# Altium schematic sheet 19V-PC-POWER.SchDoc
size B
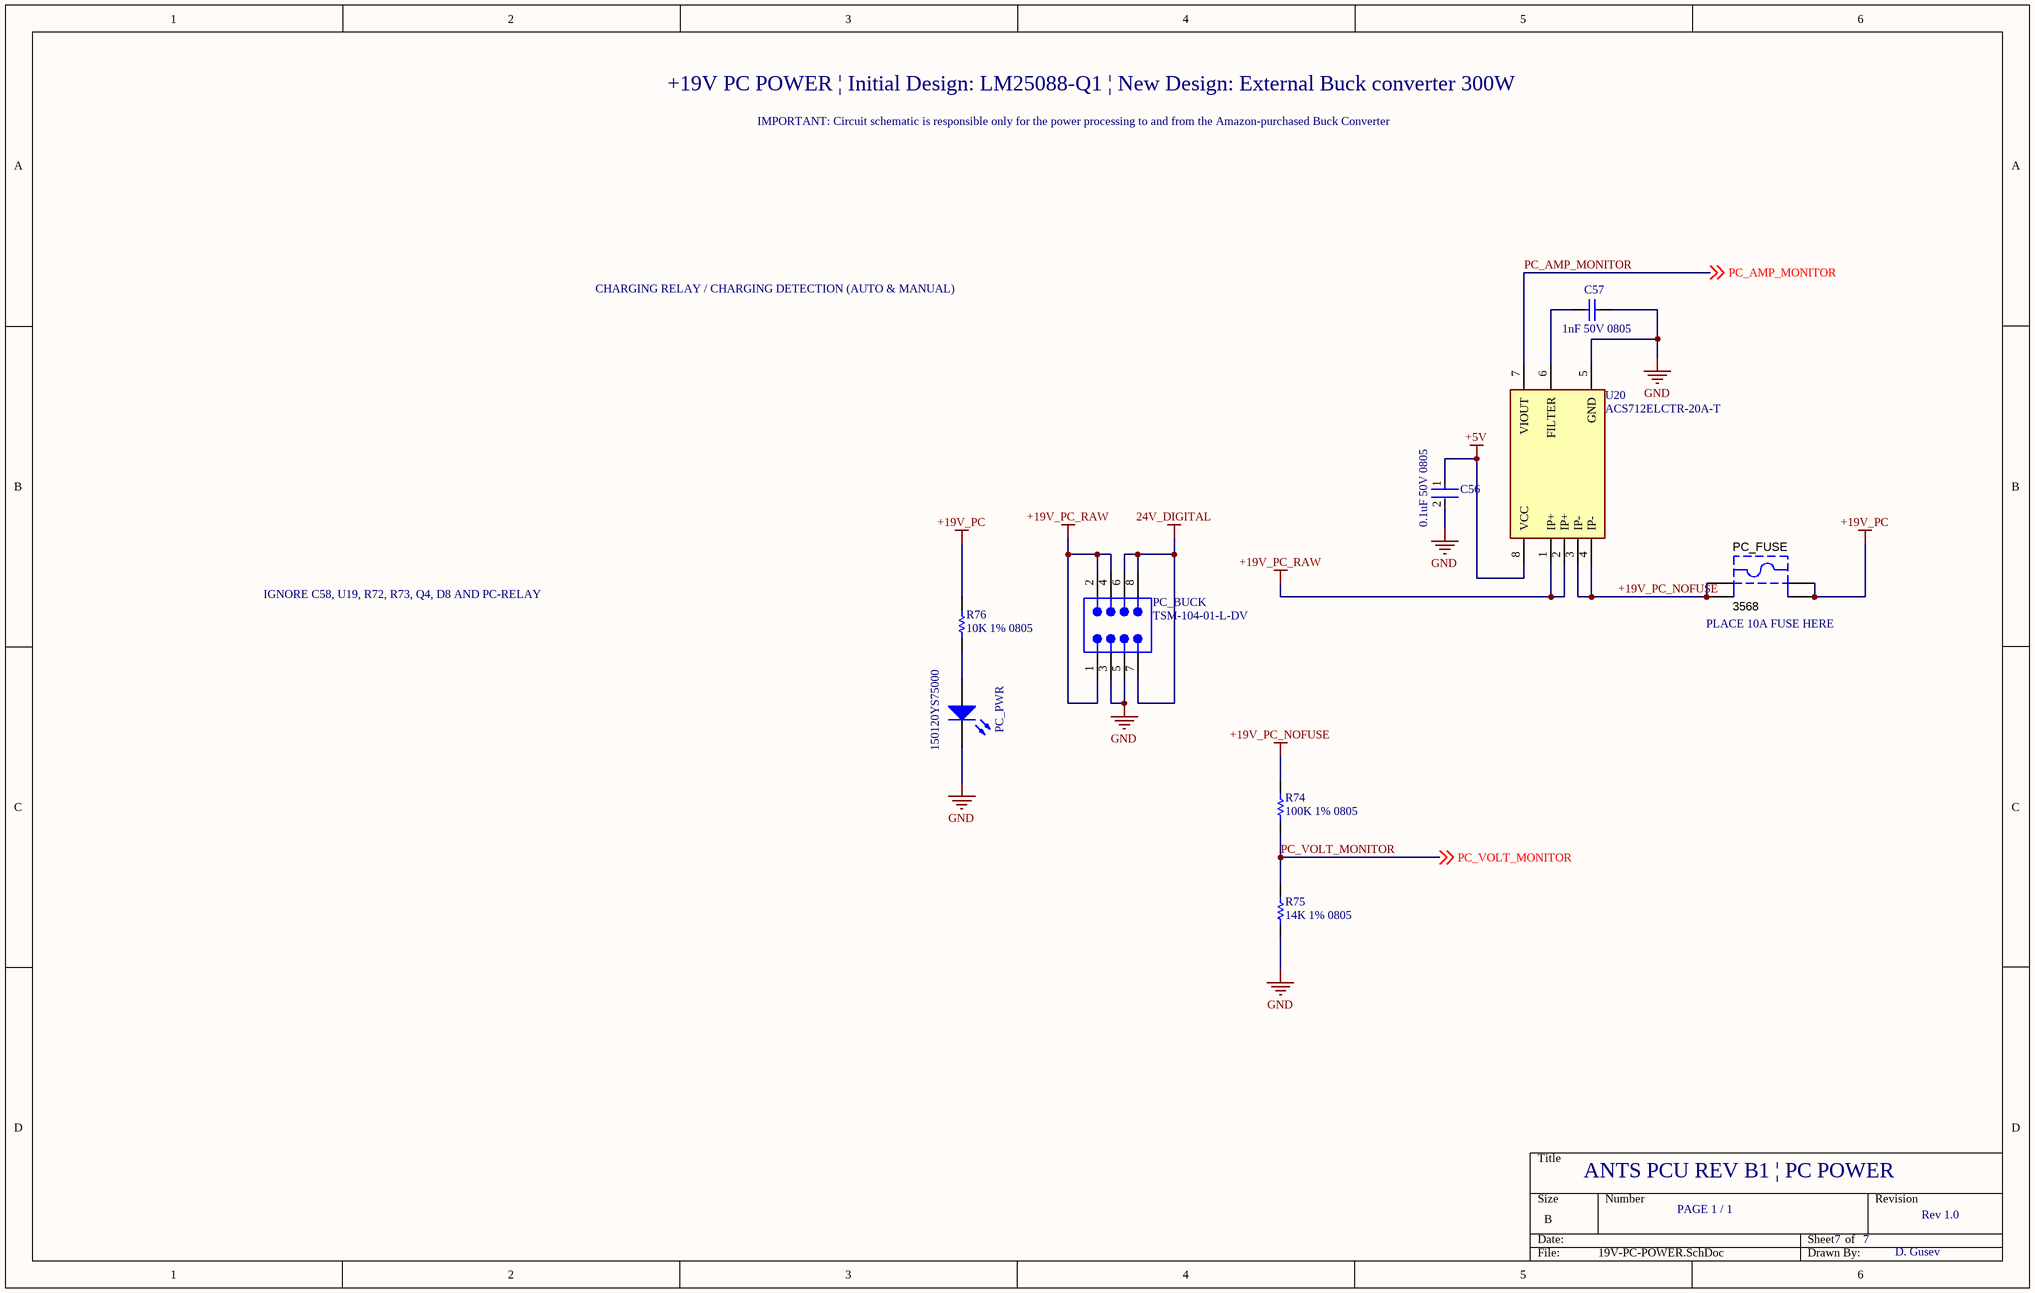
[diagram p0: 19V-PC-POWER.SchDoc]

## Parts
C56  0.1uF 50V 0805  [FP-C0805C-DN-MFG]
C57  1nF 50V 0805  [CAPC2013X94X50ML20T25]
PC_BUCK  TSM-104-01-L-DV  [SMTC-TSM-104-01-X-DV]
PC_FUSE  3568  [KSTN-3568_V]
PC_PWR  150120YS75000  [1206_A]
R74  100K 1% 0805  [RESC2013X60X35ML10T20]
R75  14K 1% 0805  [RESC2013X60X35LL10T20]
R76  10K 1% 0805  [RESC2013X60X35NL10T20]
U20  ACS712ELCTR-20A-T  [FP-LC-8-IPC_C]

## Nets
24V_DIGITAL: PC_BUCK.6 PC_BUCK.7 PC_BUCK.8
+5V: C56.1 U20.8(VCC)
+19V_PC: PC_FUSE.1 PC_FUSE.2 R76.1
+19V_PC_NOFUSE: PC_FUSE.3 PC_FUSE.4 R74.2 U20.3(IP-) U20.4(IP-)
+19V_PC_RAW: PC_BUCK.1 PC_BUCK.2 PC_BUCK.4 U20.1(IP+) U20.2(IP+)
GND: C56.2 C57.2 PC_BUCK.3 PC_BUCK.5 PC_PWR.1(K) R75.1 U20.5(GND)
PC_AMP_MONITOR: U20.7(VIOUT) ; off-sheet PC_AMP_MONITOR
PC_VOLT_MONITOR: R74.1 R75.2 ; off-sheet PC_VOLT_MONITOR
NetC57_1: C57.1 U20.6(FILTER)
NetPC_PWR_2: PC_PWR.2(A) R76.2

## Notes on the sheet
- +19V PC POWER | Initial Design: LM25088-Q1 | New Design: External Buck converter 300W
- IMPORTANT: Circuit schematic is responsible only for the power processing to and from the Amazon-purchased Buck Converter
- CHARGING RELAY / CHARGING DETECTION (AUTO & MANUAL)
- IGNORE C58, U19, R72, R73, Q4, D8 AND PC-RELAY
- (near PC_FUSE) PLACE 10A FUSE HERE
- ANTS PCU REV B1 | PC POWER
- PAGE 1 / 1
- 7
- Rev 1.0
- D. Gusev

## Library data of the parts
C56 = CMP-2007-00279-2: CAP CER 0.1UF 50V X7R 0805; Manufacturer Part Number: C0805C104K5RACTU; Manufacturer: KEMET; Value: 0.10 μF; Tolerance: 0.1; Temperature Coefficient: 30ppm/°C; Material: Ceramic; Device Class L2: Capacitors; Temperature Range Low: -55°C; Voltage Rating: 50 V; Digikey Description: CAP CER 0.1UF 50V X7R 0805; Category: Cap; ComponentLink2Description: Datasheet; Octopart: https://octopart.com/c0805c104k5ractu-kemet-143926; RoHS: TRUE; ComponentLink2URL: https://content.kemet.com/datasheets/KEM_C1003_C0G_SMD.pdf; Temperature Characteristic: X7R; Temperature: -55°C to +125°C; Height: 0.88mm; Temperature Range High: +125°C; Device Class L1: Passive Components; Automotive: No; Lead Free: Yes; Ipc Land Pattern Name: CAPC200125X78; Device Class L3: Ceramic Capacitors; Mouser Description: Cap Ceramic 0.1uF 50V X7R 10% SMD 2.0 x 1.2 mm 125 C Paper T/R; Capacitance: 0.10 μF; Package: C0805C-DN
C57 = CMP-1036-02979-2: Part Number: 08055C102KAT2A.; Manufacturer: AVX Interconnect / Elco
PC_BUCK = CMP-1024-00221-1: 0.025" SQ Post Header, Surface Mount, Vertical, -55 to 125 degC, 2.54 mm Pitch, 8-Pin, Male, RoHS; Manufacturer: Samtec; Pitch: 2.54 mm; ComponentLink1URL: http://www.samtec.com; ComponentLink1Description: Manufacturer URL; RoHS: True; ComponentLink3Description: Package Specification; PackageDescription: Double Row Gullwing ASM; DatasheetVersion: F-214; PackageVersion: DJ, 4/1991; PackageReference: TSM-104-01-X-DV; PartNumber: TSM-104-01-L-DV; ComponentLink3URL: http://www.samtec.com/documents/webfiles/cpdf/TSM-1XX-XX-XXX-XX-X-XXX-X-MKT.pdf; Temperature Range: -55 to 125 degC; ComponentLink2Description: Datasheet; Mounting Technology: Surface Mount; ComponentLink2URL: http://www.samtec.com/documents/webfiles/pdf/TSM.PDF; Orientation: Vertical
PC_FUSE = CMP-2000-05464-1: Fuse Holder, 20 A, 500 V, -50 to 145 degC, 4-Pin THD, RoHS; Manufacturer: Keystone; Package Reference: 3568; Datasheet Version: 04/2013; Datasheet URL: https://datasheet.ciiva.com/16294/m60-2p40-16294706.pdf; Manufacturer URL: http://www.keyelco.com/; Mounting Technology: ThroughHole; Package Description: 4-Pin Through Hole Device, Body 16 x 6.73 mm, Pitch 9.9 mm
PC_PWR = CMP-1426-00019-1: SMD mono-color Chip LED, WL-SMCW, Yellow; Manufacturer: Wuerth Elektronik; ComponentLink2URL: http://katalog.we-online.com/led/datasheet/150120YS75000.pdf; PartNumber: 150120YS75000; ComponentLink1URL: http://www.we-online.com; Color: Yellow; ComponentLink1Description: Manufacturer URL; PackageReference: 1206_A; ComponentLink2Description: Datasheet
R74 = CMP-2100-03668-1: Chip Resistor, 100 KOhm, +/- 1%, 0.125 W, -55 to 155 degC, 0805 (2012 Metric), RoHS, Tape and Reel; Manufacturer: Yageo; Max Power Dissipation: 125mW; Voltage Rating: 150V; Temperature Coefficient: 100ppm/degreesC; Manufacturer URL: http://www.yageo.com/; Min Operating Temperature: -55degC; Lead Pitch: 0.4mm; Composition: ThickFilm; Case Code (Metric): 2012; Military Standard: Not; Package Description: 2-Pin Surface Mounted Device, Body 2 x 1.25 mm; REACH SVHC: Unknown; RoHSCompliant: true; Depth: 1.25mm; Number of Pins: 2; Lead Free: LeadFree; Resistance: 100KOhm; Datasheet URL: http://www.yageo.com/NewPortal/yageodocoutput?fileName=/pdf/R-Chip/PYu-RC_Group_51_RoHS_L_5.pdf; Max Operating Temperature: 155degC; Case/Package: 0805; Package Quantity: 1; Case Code (Imperial): 0805; Power Rating: 125mW; Width: 0.049inch; Package Reference: 0805; Height: 0.024inch; Termination: SMD/SMT; Tolerance: 1%; Datasheet Version: Rev. 5, 10/2016; Length: 2mm; Voltage Rating (DC): 150V; Number of Terminations: 2; Packaging: TapeandReel
R75 = CMP-1013-00638-2: Part Number: RC0805FR-0714KL; Manufacturer: Yageo
R76 = CMP-1659-00013-4: Chip Resistor, 10 KOhm, +/- 1%, 0.125 W, -55 to 155 degC, 0805 (2012 Metric), RoHS, Tape and Reel; Manufacturer: Yageo; Voltage Rating: 150 V; Mount: Surface Mount; ComponentLink1Description: Manufacturer URL; ComponentLink2URL: http://www.yageo.com/documents/recent/PYu-RC_Group_51_RoHS_L_04.pdf; Pins: 2; Length: 2 mm; Min Operating Temperature: -55 degC; Height: 0.5 mm; Mounting Technology: Surface Mount; RoHSCompliant: true; REACH SVHC: No SVHC; ComponentLink1URL: http://www.yageo.com/; Max Operating Temperature: 155 degC; PackageReference: 0805; DatasheetVersion: Rev. 4, 02/2016; Package Quantity: 5000; Packaging: Tape and Reel; ComponentLink2Description: Datasheet; PackageDescription: 2-Pin Surface Mounted Device, Body 2 x 1.25 mm
U20 = CMP-0826-00001-2: SENSOR CURRENT HALL 20A AC/DC; Accuracy: 1.5%; Quiescent Current: 10mA; Response Time: 5us; Sensitivity: 100mV/A; Min Supply Voltage: 4.5V; Number of Channels: 1; Polarity: Bidirectional; Frequency: 80kHz; Max Supply Current: 13mA; Operating Supply Voltage: 5V; Max Supply Voltage: 5.5V; Max Operating Temperature: 85°C; Case/Package: SOIC; REACH SVHC: No SVHC; Min Operating Temperature: -40°C; Current Sensing: 20A; Packaging: Tape and Reel; Lead Free: Lead Free; Series: -; Length: 4.9mm; Number of Pins: 8; Linearity: 1.5%; Radiation Hardening: No; Package Quantity: 1; Termination: SMD/SMT; Output Current: 10mA; Height: 1.5mm; RoHS Compliant: Yes; Width: 3.9mm; Bandwidth: 80kHz